# Altium schematic sheet 09-multimodal-flash.SchDoc
size A4; SheetNumber: 3; SheetTotal: 10
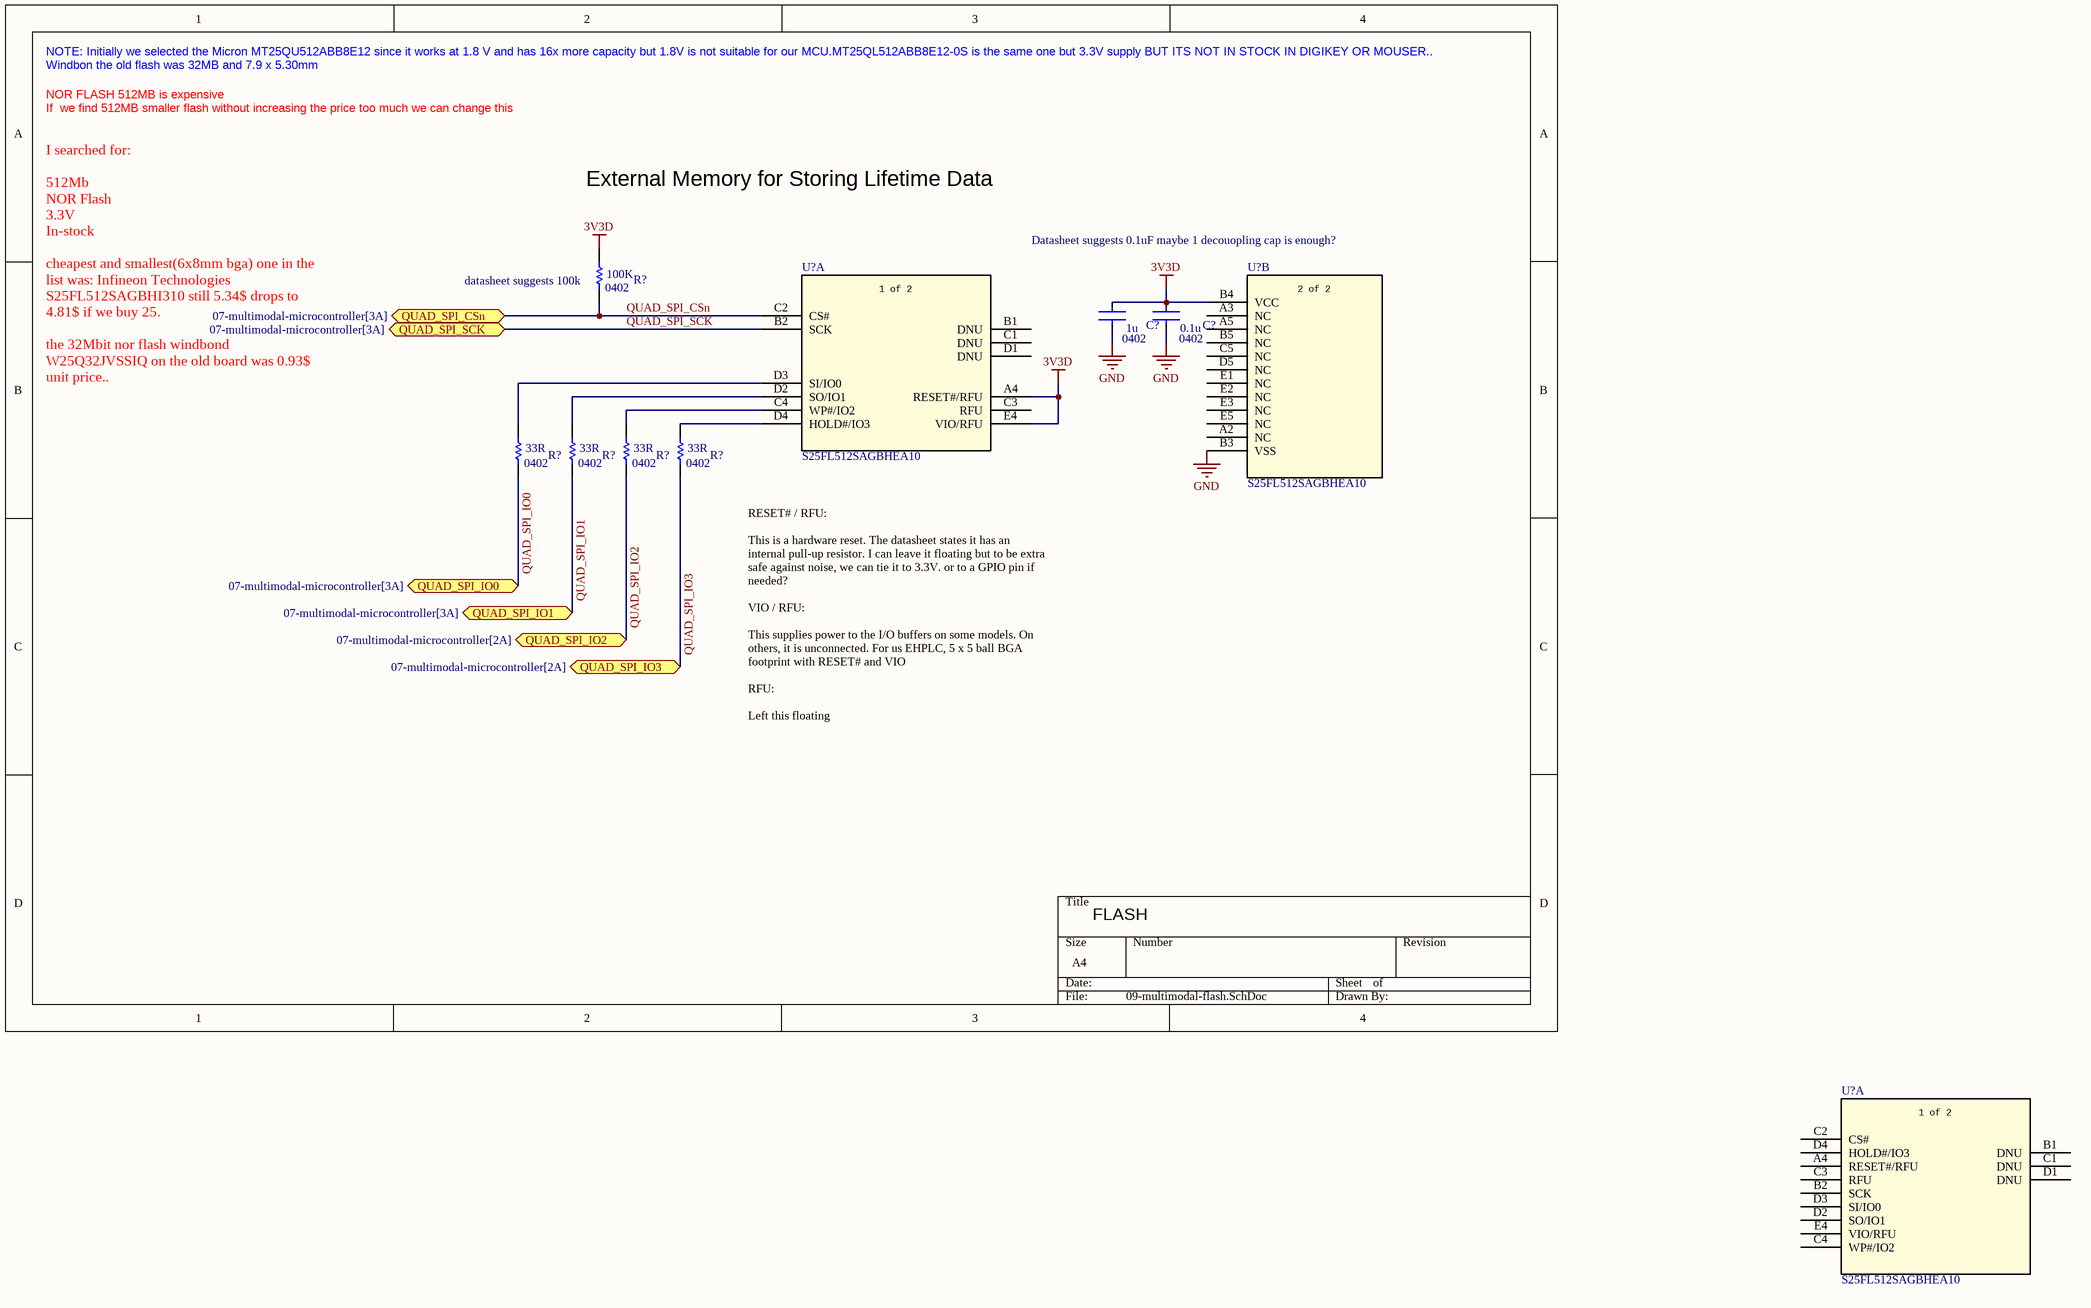
[diagram p0: 09-multimodal-flash.SchDoc]

## Parts
(Parts that share a designator on the sheet are numbered #1, #2 ... from top to bottom, then left to right.)
C?#1  C1005X5R1V105K050BC  [CAPTDK0402]  (value not drawn)
C?#2  C1005X7R1H104K050BB  [CAPTDK0402]  (value not drawn)
R?#1  RMCF0402FT100K  [RES-STACK-POLE-0402]  (value not drawn)
R?#2  RMCF0402FT33R0  [RES-STACK-POLE-0402]  (value not drawn)
R?#3  RMCF0402FT33R0  [RES-STACK-POLE-0402]  (value not drawn)
R?#4  RMCF0402FT33R0  [RES-STACK-POLE-0402]  (value not drawn)
R?#5  RMCF0402FT33R0  [RES-STACK-POLE-0402]  (value not drawn)
U?#1  S25FL512SAGBHEA10  [BGA5x5_S25FL512SAGBHEA10_INF]  (part B of 2)
U?#2  S25FL512SAGBHEA10  [BGA5x5_S25FL512SAGBHEA10_INF]  (part A of 2)
U?#3  S25FL512SAGBHEA10  [BGA5x5_S25FL512SAGBHEA10_INF]  (part A of 2)

## Ports
QUAD_SPI_CSn (bidir, see 07-multimodal-microcontroller[3A]), QUAD_SPI_IO0 (bidir, see 07-multimodal-microcontroller[3A]), QUAD_SPI_IO1 (bidir, see 07-multimodal-microcontroller[3A]), QUAD_SPI_IO2 (bidir, see 07-multimodal-microcontroller[2A]), QUAD_SPI_IO3 (bidir, see 07-multimodal-microcontroller[2A]), QUAD_SPI_SCK (bidir, see 07-multimodal-microcontroller[3A])

## Nets
3V3D: C?#1.1 C?#2.1 R?#1.2 U?#1.B4(VCC) U?#2.A4(RESET#/RFU) U?#2.E4(VIO/RFU)
GND: C?#1.2 C?#2.2 U?#1.B3(VSS)
QUAD_SPI_CSn: R?#1.1 U?#2.C2(CS#) ; port QUAD_SPI_CSn
QUAD_SPI_IO0: R?#2.1 ; port QUAD_SPI_IO0
QUAD_SPI_IO1: R?#3.1 ; port QUAD_SPI_IO1
QUAD_SPI_IO2: R?#4.1 ; port QUAD_SPI_IO2
QUAD_SPI_IO3: R?#5.1 ; port QUAD_SPI_IO3
QUAD_SPI_SCK: U?#2.B2(SCK) ; port QUAD_SPI_SCK
NetR?#2_2: R?#2.2 U?#2.D3(SI/IO0)
NetR?#3_2: R?#3.2 U?#2.D2(SO/IO1)
NetR?#4_2: R?#4.2 U?#2.C4(WP#/IO2)
NetR?#5_2: R?#5.2 U?#2.D4(HOLD#/IO3)

Not connected (* = marked no-connect by the designer): U?#1 A2(NC) A3(NC) A5(NC) B5(NC) C5(NC) D5(NC) E1(NC) E2(NC) E3(NC) E5(NC); U?#2 B1(DNU) C1(DNU) C3(RFU) D1(DNU); U?#3 A4(RESET#/RFU) B1(DNU) B2(SCK) C1(DNU) C2(CS#) C3(RFU) C4(WP#/IO2) D1(DNU) D2(SO/IO1) D3(SI/IO0) D4(HOLD#/IO3) E4(VIO/RFU)

## Notes on the sheet
- NOTE: Initially we selected the Micron MT25QU512ABB8E12 since it works at 1.8 V and has 16x more capacity but 1.8V is not suitable for our MCU.MT25QL512ABB8E12-0S is the same one but 3.3V supply BUT ITS NOT IN STOCK IN DIGIKEY OR MOUSER..  Windbon the old flash was 32MB and 7.9 x 5.30mm
- NOR FLASH 512MB is expensive
  If  we find 512MB smaller flash without increasing the price too much we can change this
- External Memory for Storing Lifetime Data
- Datasheet suggests 0.1uF maybe 1 decouopling cap is enough?
- (near R?#1) datasheet suggests 100k
- I searched for:
  512Mb
  NOR Flash
  3.3V
  In-stock
  cheapest and smallest(6x8mm bga) one in the list was: Infineon Technologies S25FL512SAGBHI310 still 5.34$ drops to 4.81$ if we buy 25.
  the 32Mbit nor flash windbond W25Q32JVSSIQ on the old board was 0.93$ unit price..
- RESET# / RFU:
  This is a hardware reset. The datasheet states it has an internal pull-up resistor. I can leave it floating but to be extra safe against noise, we can tie it to 3.3V. or to a GPIO pin if needed?
  VIO / RFU:
  This supplies power to the I/O buffers on some models. On others, it is unconnected. For us EHPLC, 5 x 5 ball BGA footprint with RESET# and VIO
  RFU:
  Left this floating
- FLASH
- (in symbol C1005X5R1V105K050BC) 1u; 0402
- (in symbol C1005X7R1H104K050BB) 0.1u; 0402
- (in symbol RMCF0402FT33R0) 33R; 0402
- (in symbol RMCF0402FT100K) 100K; 0402
- (in symbol S25FL512SAGBHEA10, part A) 1 of 2
- (in symbol S25FL512SAGBHEA10, part B) 2 of 2

## Library data of the parts
C?#1 = C1005X5R1V105K050BC: CAP CER 1UF 35V X5R 0402; Supplier 1: Digi-Key; Supplier Part Number 1: 445-9073-1-ND
C?#2 = C1005X7R1H104K050BB: CAP CER 0.1UF 50V X7R 0402; Supplier 1: Digi-Key; Supplier Part Number 1: 445-5932-1-ND
R?#1 = RMCF0402FT100K: RES 100K OHM 1% 1/16W 0402; Supplier 1: Digi-Key; Supplier Part Number 1: RMCF0402FT100KCT-ND
R?#2-R?#5 = RMCF0402FT33R0: RES 33 OHM 1% 1/16W 0402; Supplier 1: Digi-Key; Supplier Part Number 1: RMCF0402FT33R0CT-ND
U?#1 U?#2 = S25FL512SAGBHEA10: FLASH - NOR Memory IC 512Mbit SPI - Quad I/O 133 MHz 24-BGA (6x8); Manufacturer_Name: Infineon; Type: Memory; Copyright: Copyright (C) 2025 Ultra Librarian. All rights reserved.; Manufacturer_Part_Number: S25FL512SAGBHEA10; RefDes: RefDes
U?#3 = S25FL512SAGBHEA10: Description; Manufacturer_Name: Infineon; Type: Memory; Copyright: Copyright (C) 2025 Ultra Librarian. All rights reserved.; Manufacturer_Part_Number: S25FL512SAGBHEA10; RefDes: RefDes